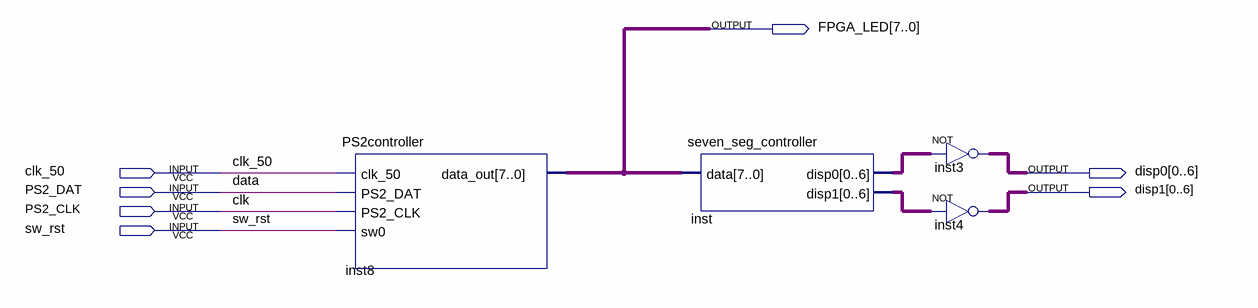
[diagram p0: schematic sheet]
// Quartus schematic PS2_test.bdf as structural Verilog: 4 symbols, 7 pins
module PS2_test (
  input  clk_50,
  input  PS2_DAT,
  input  PS2_CLK,
  input  sw_rst,
  output [7:0] FPGA_LED,
  output [0:6] disp0,
  output [0:6] disp1
);

  wire [6:0] inst_disp0, inst_disp1;

  PS2controller inst8 (.clk_50(clk_50), .PS2_DAT(PS2_DAT), .PS2_CLK(PS2_CLK), .sw0(sw_rst), .data_out(FPGA_LED));
  seven_seg_controller inst (.data(FPGA_LED), .disp0(inst_disp0), .disp1(inst_disp1));
  assign disp0 = ~inst_disp0;  // NOT inst3, 7 bits wide
  assign disp1 = ~inst_disp1;  // NOT inst4, 7 bits wide

  // Other names for the same wires on the sheet: clk = PS2_CLK; data = PS2_DAT
endmodule
